# Altium schematic sheet Power.SchDoc
size A; SheetNumber: 3; SheetTotal: 3
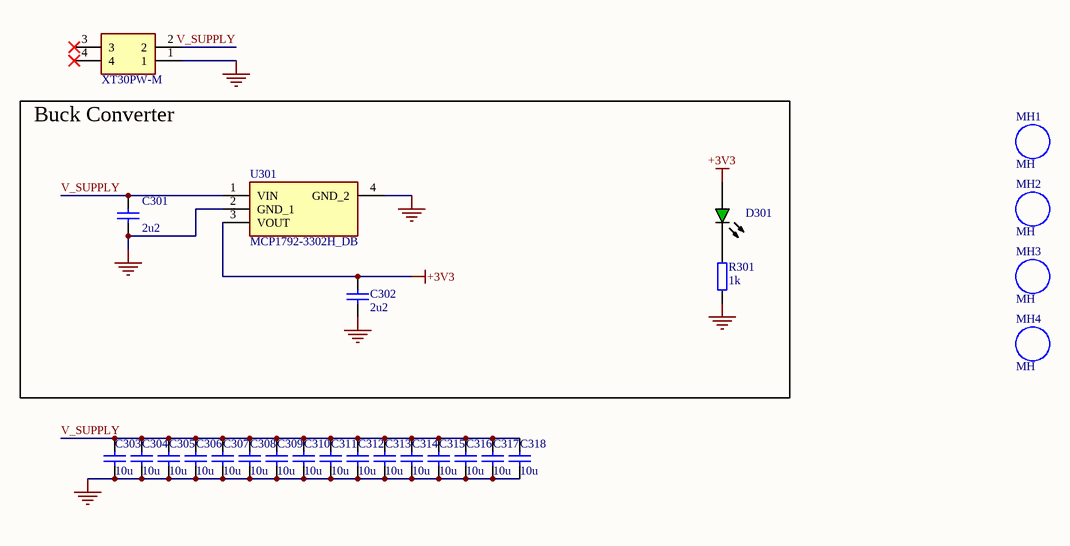
[diagram p0: Power.SchDoc]

## Parts
?  XT30PW-M  [XT30PWM]
C301  2u2  [CAPC1608X90N]
C302  2u2  [CAPC1608X90N]
C303  10u  [CAPC1608X90N]
C304  10u  [CAPC1608X90N]
C305  10u  [CAPC1608X90N]
C306  10u  [CAPC1608X90N]
C307  10u  [CAPC1608X90N]
C308  10u  [CAPC1608X90N]
C309  10u  [CAPC1608X90N]
C310  10u  [CAPC1608X90N]
C311  10u  [CAPC1608X90N]
C312  10u  [CAPC1608X90N]
C313  10u  [CAPC1608X90N]
C314  10u  [CAPC1608X90N]
C315  10u  [CAPC1608X90N]
C316  10u  [CAPC1608X90N]
C317  10u  [CAPC1608X90N]
C318  10u  [CAPC1608X90N]
D301  GRN_0402_LED  [150040GS73220]  (value not drawn)
MH1  MH  [MH]
MH2  MH  [MH]
MH3  MH  [MH]
MH4  MH  [MH]
R301  1k  [RESC1005X40N]
U301  MCP1792-3302H_DB  [SOT230P700X180-4N]

## Blocks framed on the sheet
Buck Converter: C301 C302 D301 R301 U301

## Nets
+3V3: C302.2 D301.1(A) U301.3(VOUT)
GND: ?.1 C301.1 C302.1 C303.1 C304.1 C305.1 C306.1 C307.1 C308.1 C309.1 C310.1 C311.1 C312.1 C313.1 C314.1 C315.1 C316.1 C317.1 C318.1 R301.2 U301.2(GND_1) U301.4(GND_2)
V_SUPPLY: ?.2 C301.2 C303.2 C304.2 C305.2 C306.2 C307.2 C308.2 C309.2 C310.2 C311.2 C312.2 C313.2 C314.2 C315.2 C316.2 C317.2 C318.2 U301.1(VIN)
NetD301_2: D301.2(K) R301.1

Not connected (* = marked no-connect by the designer): ? 3* 4*

## Library data of the parts
? = XT30PW-M: Connector; Manufacturer_Name: Amass; Datasheet Link: https://www.tme.eu/sl/Document/ce4077e36b79046da520ca73227e15de/XT30PW%20SPEC.pdf; Height: 5mm; Manufacturer_Part_Number: XT30PW-M
C301 C302 = CAP_0603_50V: Capacitor; Manufacturer_Name: Samsung Electro-Mechanics; Manufacturer_Part_Number: CL05B104KO5NNNC; Datasheet Link: https://datasheet.datasheetarchive.com/originals/distributors/Datasheets-DGA10/2408147.pdf; Height: 0.55mm; Mouser Part Number: 187-CL05B104KO5NNNC; Mouser Price/Stock: https://www.mouser.co.uk/ProductDetail/Samsung-Electro-Mechanics/CL05B104KO5NNNC?qs=hqM3L16%252BxlfT2SKOuAUq6Q%3D%3D; Arrow Part Number: CL05B104KO5NNNC; Arrow Price/Stock: https://www.arrow.com/en/products/cl05b104ko5nnnc/samsung-electro-mechanics
C303-C318 = CAP_0805_50V: Capacitor; Manufacturer_Name: Samsung Electro-Mechanics; Manufacturer_Part_Number: CL05B104KO5NNNC; Datasheet Link: https://datasheet.datasheetarchive.com/originals/distributors/Datasheets-DGA10/2408147.pdf; Height: 0.55mm; Mouser Part Number: 187-CL05B104KO5NNNC; Mouser Price/Stock: https://www.mouser.co.uk/ProductDetail/Samsung-Electro-Mechanics/CL05B104KO5NNNC?qs=hqM3L16%252BxlfT2SKOuAUq6Q%3D%3D; Arrow Part Number: CL05B104KO5NNNC; Arrow Price/Stock: https://www.arrow.com/en/products/cl05b104ko5nnnc/samsung-electro-mechanics
R301 = RES_0402
U301 = MCP1792-3302H_DB: Integrated Circuit; Manufacturer_Name: Microchip; Manufacturer_Part_Number: MCP1792-3302H/DB; Datasheet Link: http://ww1.microchip.com/downloads/en/DeviceDoc/MCP1792-Family-Data-Sheet-DS20006229C.pdf; Height: 1.8mm; Mouser Part Number: 579-MCP1792-3302HDB; Mouser Price/Stock: https://www.mouser.co.uk/ProductDetail/Microchip-Technology/MCP1792-3302H-DB?qs=mAH9sUMRCttoG5iLrM6fSg%3D%3D; Arrow Part Number: MCP1792-3302H/DB; Arrow Price/Stock: https://www.arrow.com/en/products/mcp1792-3302hdb/microchip-technology